# EAGLE design Quick Mix (EAGLE 9.0.0)
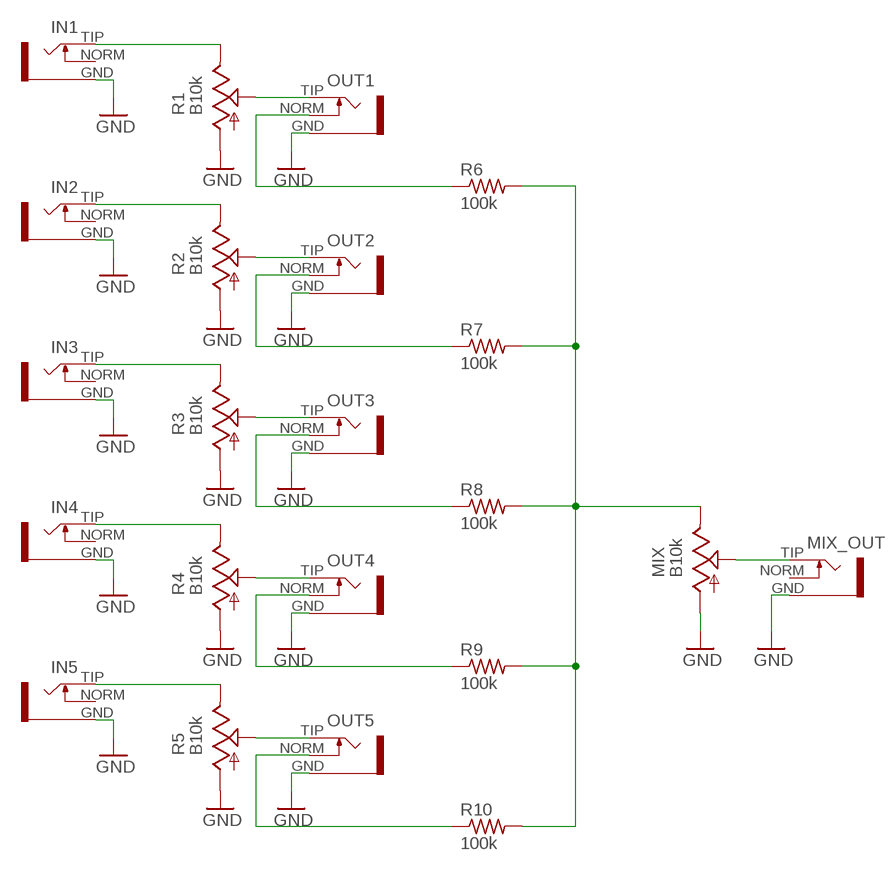
[diagram p0: schematic, sheet 1]

## Parts
IN1  INSTRUO_S_JACK_SMALL2  [INSTRUO_S_JACK_SMALL2]
IN2  INSTRUO_S_JACK_SMALL2  [INSTRUO_S_JACK_SMALL2]
IN3  INSTRUO_S_JACK_SMALL2  [INSTRUO_S_JACK_SMALL2]
IN4  INSTRUO_S_JACK_SMALL2  [INSTRUO_S_JACK_SMALL2]
IN5  INSTRUO_S_JACK_SMALL2  [INSTRUO_S_JACK_SMALL2]
MIX  B10k  OG-POTS_POT_USVERTICAL  [OG-POTS_ALPS_POT_VERTICAL]
MIX_OUT  INSTRUO_S_JACK_SMALL2  [INSTRUO_S_JACK_SMALL2]
OUT1  INSTRUO_S_JACK_S2_INV  [INSTRUO_S_JACK_S2_INV]
OUT2  INSTRUO_S_JACK_S2_INV  [INSTRUO_S_JACK_S2_INV]
OUT3  INSTRUO_S_JACK_S2_INV  [INSTRUO_S_JACK_S2_INV]
OUT4  INSTRUO_S_JACK_S2_INV  [INSTRUO_S_JACK_S2_INV]
OUT5  INSTRUO_S_JACK_S2_INV  [INSTRUO_S_JACK_S2_INV]
R1  B10k  OG-POTS_POT_USVERTICAL  [OG-POTS_ALPS_POT_VERTICAL]
R2  B10k  OG-POTS_POT_USVERTICAL  [OG-POTS_ALPS_POT_VERTICAL]
R3  B10k  OG-POTS_POT_USVERTICAL  [OG-POTS_ALPS_POT_VERTICAL]
R4  B10k  OG-POTS_POT_USVERTICAL  [OG-POTS_ALPS_POT_VERTICAL]
R5  B10k  OG-POTS_POT_USVERTICAL  [OG-POTS_ALPS_POT_VERTICAL]
R6  100k  R-US_R0603  [R0603]
R7  100k  R-US_R0603  [R0603]
R8  100k  R-US_R0603  [R0603]
R9  100k  R-US_R0603  [R0603]
R10  100k  R-US_R0603  [R0603]

## Nets
GND: IN1.GND IN2.GND IN3.GND IN4.GND IN5.GND MIX.P$3(A) MIX_OUT.GND OUT1.GND OUT2.GND OUT3.GND OUT4.GND OUT5.GND R1.P$3(A) R2.P$3(A) R3.P$3(A) R4.P$3(A) R5.P$3(A)
N$1: IN1.TIP R1.P$1(E)
N$2: OUT4.TIP R4.P$2(S)
N$3: IN2.TIP R2.P$1(E)
N$4: OUT3.TIP R3.P$2(S)
N$5: IN3.TIP R3.P$1(E)
N$6: OUT2.TIP R2.P$2(S)
N$7: IN4.TIP R4.P$1(E)
N$8: OUT1.TIP R1.P$2(S)
N$9: IN5.TIP R5.P$1(E)
N$10: OUT5.TIP R5.P$2(S)
N$11: OUT1.NORM R6.1
N$12: OUT2.NORM R7.1
N$13: OUT3.NORM R8.1
N$14: OUT4.NORM R9.1
N$15: OUT5.NORM R10.1
N$16: MIX.P$1(E) R6.2 R7.2 R8.2 R9.2 R10.2
N$17: MIX.P$2(S) MIX_OUT.TIP
Unconnected: IN1.NORM IN2.NORM IN3.NORM IN4.NORM IN5.NORM MIX_OUT.NORM

## Library data of the parts
IN1-IN5 MIX_OUT = uClouds_002:INSTRUO_S_JACK_SMALL2
MIX R1-R5 = veils_v40:OG-POTS_POT_US
OUT1-OUT5 = uClouds_002:INSTRUO_S_JACK_S2_INV
R6-R10 = adafruit:R-US_: RESISTOR, American symbol

## Board
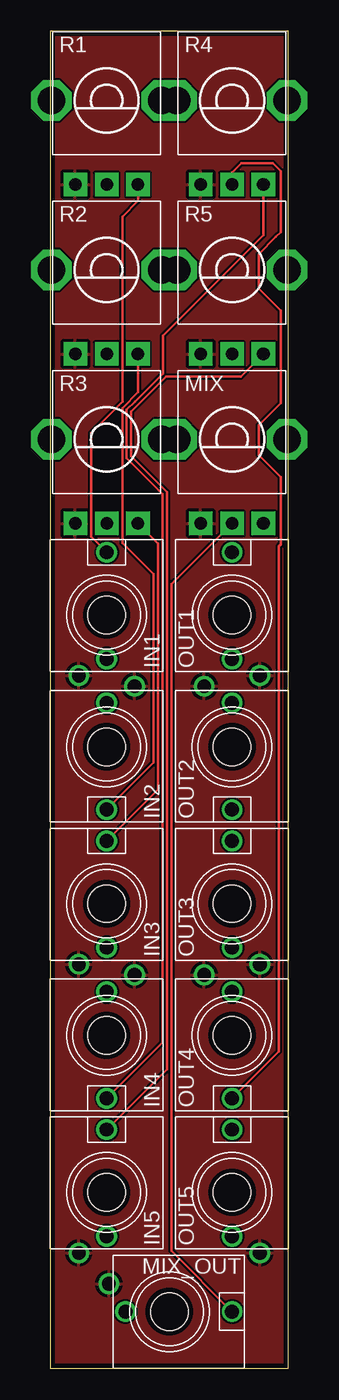
[diagram p1: board, top side]
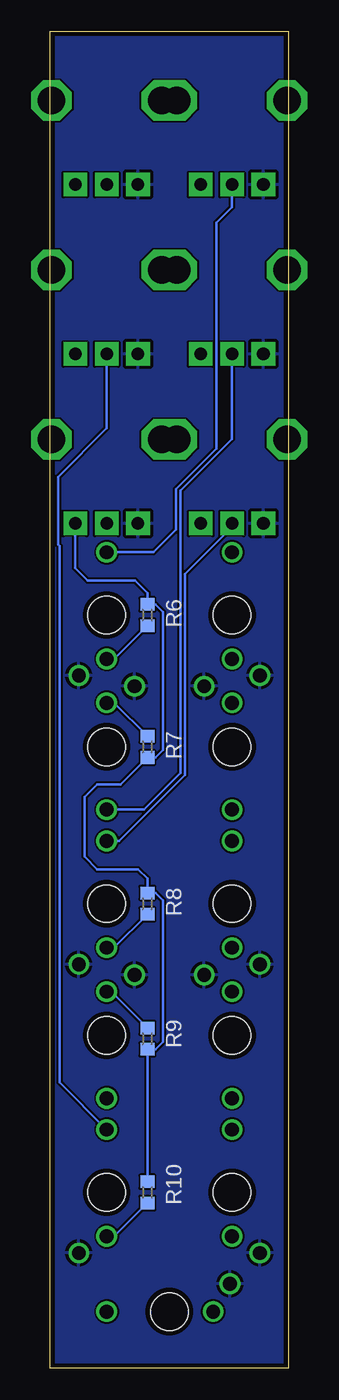
[diagram p2: board, bottom side, seen from below]

Size 19 x 106.5 mm. Coordinates in mm from the lower left corner, seen from the top.
Outline: 0,0 19,0 19,106.5 0,106.5 0,0
Copper layers (1*16): Top 0.0356mm / dielectric 1.5011mm / Bottom 0.0356mm
Design rules "oshpark-2layer": minimum track width 6mil, minimum drill 13mil, track to track 6mil, track to pad 6mil, pad to pad 6mil, via to via 6mil, smd to smd 6mil, copper to edge 15mil, drill to drill 6mil, minimum pad ring 7mil, minimum via ring 7mil, stop-mask expansion 2.5mil, vias tented up to drill 0mil, thermal gap 10mil
Holes 3 mm at 4.5,37 14.5,37 14.5,49.5 4.5,49.5 4.5,60 14.5,60 14.5,26.5 4.5,26.5 4.5,14 14.5,14 9.5,4.5

### Footprints (pad centres in the part's own frame; a part is rotated, then mirrored left to right if it is on the bottom)
INSTRUO_S_JACK_SMALL2 = drill 1.1: GND -2.223,-4.826; NORM 0,-3.5; TIP 0,5
OG-POTS_ALPS_POT_VERTICAL = drill 1 pad 1.88 square: P$1 -2.5,6.7; P$2 0,6.7; P$3 2.5,6.7 | drill 2.2 pad 3.175 octagon: P$4 -4.4,0; P$5 4.4,0
INSTRUO_S_JACK_S2_INV = drill 1.1: GND 2.223,-4.826; NORM 0,-3.5; TIP 0,5
R0603 = smd 1 x 1.1: 1 -0.85,0; 2 0.85,0

### Placement (x,y rotation side)
IN1  4.5,60 0 top
IN2  4.5,49.5 180 top
IN3  4.5,37 0 top
IN4  4.5,26.5 180 top
IN5  4.5,14 0 top
MIX  14.5,74 180 top
MIX_OUT  9.5,4.5 270 top
OUT1  14.5,60 0 top
OUT2  14.5,49.5 180 top
OUT3  14.5,37 0 top
OUT4  14.5,26.5 180 top
OUT5  14.5,14 0 top
R1  4.5,101 180 top
R2  4.5,87.5 180 top
R3  4.5,74 180 top
R4  14.5,101 180 top
R5  14.5,87.5 180 top
R6  11.25,60 90 bottom
R7  11.25,49.5 270 bottom
R8  11.25,37 90 bottom
R9  11.25,26.25 270 bottom
R10  11.25,14 90 bottom

### Tracks (layer width: path | path; a pad name or v marks a point on that pad's centre or on a via)
GND
  pour Top: -0.5,-1 19.5,-1 19.5,107 -0.5,107
  pour Bottom: -1,-1.5 20.5,-1.5 20.5,107.5 -1,107.5
N$1
  Top 0.2: IN1.TIP 3.25,66.25 3.25,74.5 5.75,77 5.75,91.75 7,93 R1.P$1
N$2
  Top 0.2: R4.P$2 14.5,95.25 15.25,96 17.75,96 18.38,95.38 18.38,90.5 18,90.12 16.62,88.75 16.62,86 18.38,84.25 18.38,76.88 16.62,75.12 16.62,72.75 18.38,71 18.38,65.62 18.25,65.5 18.25,25.25 OUT4.TIP
N$3
  Top 0.2: R2.P$1 7,77.75 | 7,77.75 | 7,77.75 5.75,76.5 5.75,65.75 8.25,63.25 8.25,48.25 IN2.TIP
N$4
  Bottom 0.2: R3.P$2 4.5,67 8.25,63.25 8.25,47.25 13.5,42 OUT3.TIP
N$5
  Top 0.2: IN3.TIP 8.6,46.1 8.6,65.7 R3.P$1
N$6
  Bottom 0.2: R2.P$2 4.5,74 8.6,69.9 8.6,47.4 11.5,44.5 OUT2.TIP
N$7
  Top 0.2: IN4.TIP 8.96,25.95 8.96,69.65 6.1,72.5 6.1,76.35 6.75,77 9,79.25 9,82.25 17,90.25 R4.P$1
N$8
  Bottom 0.2: OUT1.TIP 10.75,65 8.96,66.8 8.96,70.04 5.75,73.25 5.75,91.25 4.5,92.5 R1.P$2
N$9
  Top 0.2: R5.P$1 15.2,79 9.25,79 6.46,76.21 6.46,72.65 9.31,69.79 9.31,23.81 IN5.TIP
N$10
  Bottom 0.2: R5.P$2 14.5,74.88 18.38,71 18.38,65.62 18.25,65.5 18.25,22.75 OUT5.TIP
N$11
  Bottom 0.2: OUT1.NORM 13.9,56.5 R6.1
N$12
  Bottom 0.2: OUT2.NORM 13.9,53 R7.1
N$13
  Bottom 0.2: OUT3.NORM 13.9,33.5 R8.1
N$14
  Bottom 0.2: OUT4.NORM 14.15,30 R9.1
N$15
  Bottom 0.2: OUT5.NORM 13.9,10.5 R10.1
N$16
  Bottom 0.2: R10.2 R9.2 10.6,25.4 10,26 10,37.25 10.6,37.85 R8.2 11.25,39 12,39.75 15.25,39.75 16.25,40.75 16.25,45.5 15.25,46.5 13.4,46.5 R7.2 10.6,48.65 10,49.25 10,60.25 10.6,60.85 R6.2 11.25,61.75 12.25,62.75 16,62.75 17,63.75 MIX.P$1
N$17
  Top 0.2: MIX.P$2 9.66,62.46 9.66,9.34 MIX_OUT.TIP